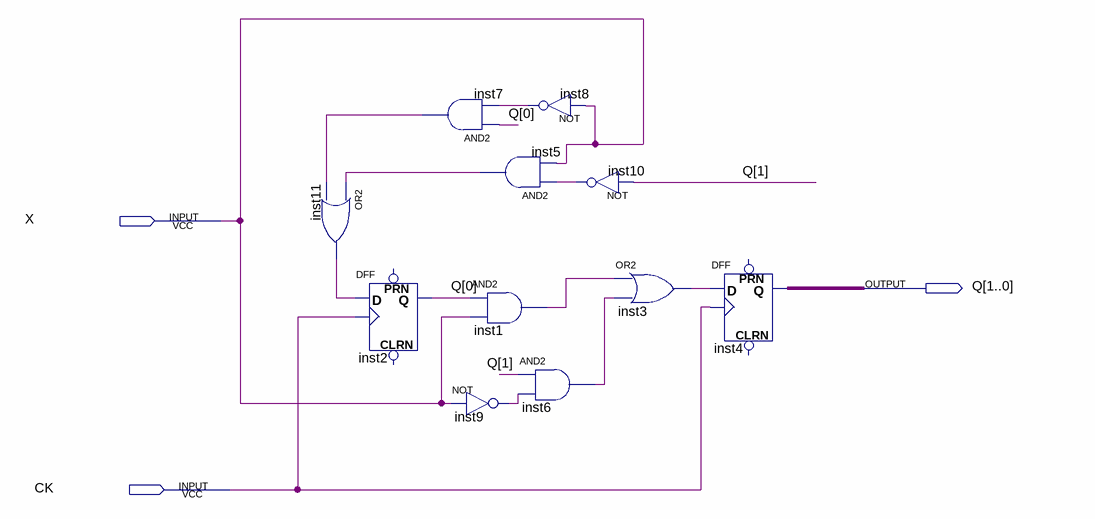
[diagram p0: schematic sheet]
// Quartus schematic MEF.bdf as structural Verilog: 11 symbols, 3 pins
module MEF (
  input  X,
  input  CK,
  output [1:0] Q
);

  wire inst1_out, inst3_out, inst5_out, inst6_out, inst7_out, inst8_out, inst9_out, inst10_out, inst11_out;

  or inst11 (inst11_out, inst5_out, inst7_out);
  DFF inst2 (.CLK(CK), .D(inst11_out), .Q(Q[0]));  // open: CLRN, PRN
  and inst7 (inst7_out, Q[0], inst8_out);
  not inst9 (inst9_out, X);
  not inst8 (inst8_out, X);
  and inst5 (inst5_out, inst10_out, X);
  and inst1 (inst1_out, Q[0], X);
  and inst6 (inst6_out, Q[1], inst9_out);
  not inst10 (inst10_out, Q[1]);
  or inst3 (inst3_out, inst1_out, inst6_out);
  DFF inst4[1:0] (.CLK(CK), .D(inst3_out), .Q(Q));  // open: CLRN, PRN
endmodule
